# EAGLE schematic sheet (EAGLE 7.2.0)
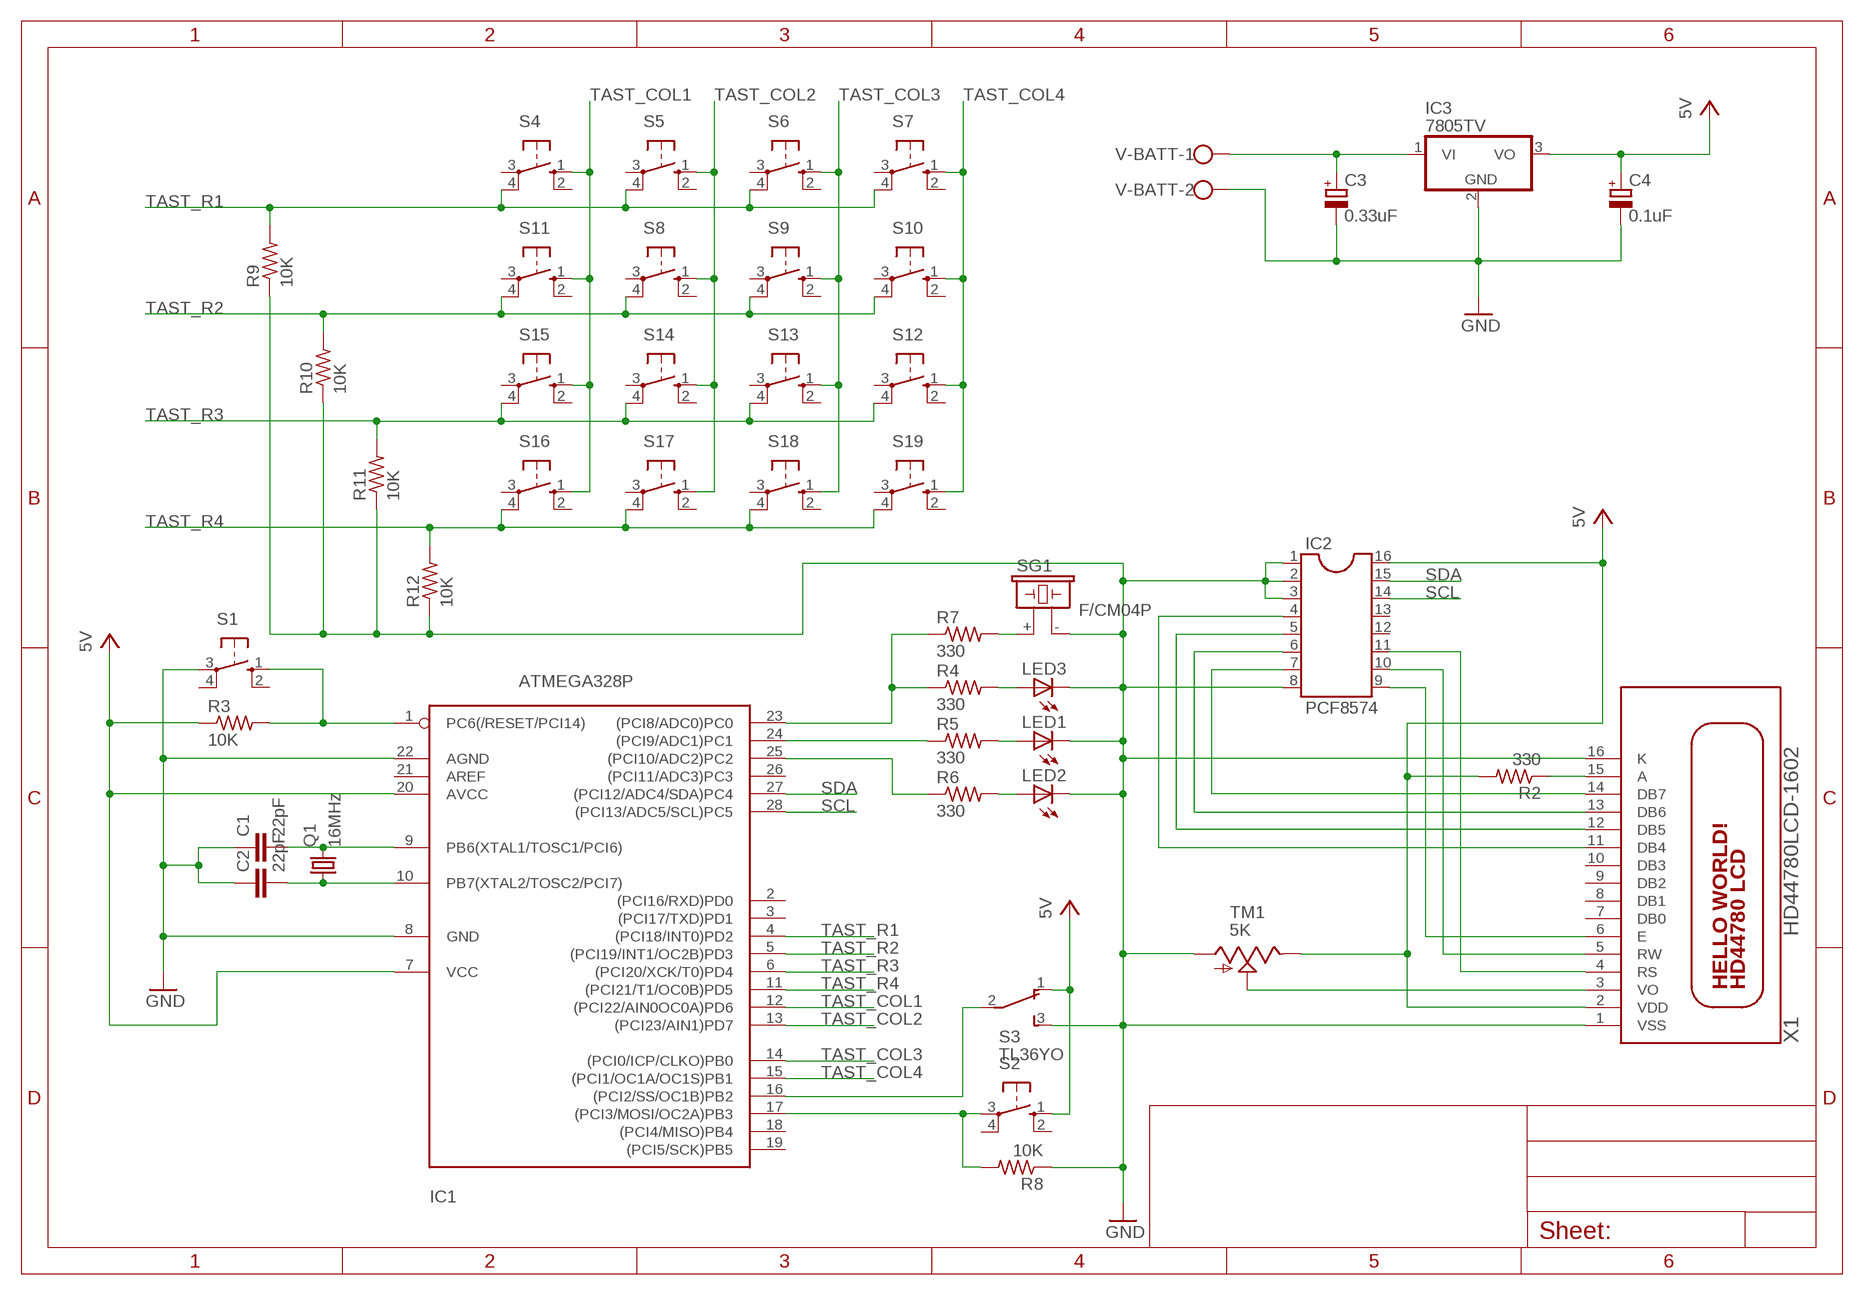
[diagram p0: schematic, sheet 1]

## Parts
C1  22pF  C-EU025-024X044  [C025-024X044]
C2  22pF  C-EU025-024X044  [C025-024X044]
C3  0.33uF  CPOL-EUE5-6  [E5-6]
C4  0.1uF  CPOL-EUE5-6  [E5-6]
FRAME1  A4L-LOC  [A4L-LOC]
IC1  ATMEGA328P  ATMEGA168-20P  [DIL28-3]
IC2  PCF8574  DIL16  [DIL16]
IC3  7805TV  [TO220V]
LED1  LED5MM  [LED5MM]
LED2  LED3MM  [LED3MM]
LED3  LED3MM  [LED3MM]
Q1  16MHz  CRYSTALHC49S  [HC49/S]
R2  330  R-US_0204/7  [0204/7]
R3  10K  R-US_0207/12  [0207/12]
R4  330  R-US_0207/12  [0207/12]
R5  330  R-US_0207/12  [0207/12]
R6  330  R-US_0207/12  [0207/12]
R7  330  R-US_0207/12  [0207/12]
R8  10K  R-US_0207/12  [0207/12]
R9  10K  R-US_0207/12  [0207/12]
R10  10K  R-US_0207/12  [0207/12]
R11  10K  R-US_0207/12  [0207/12]
R12  10K  R-US_0207/12  [0207/12]
S1  40-XX  [B3F-40XX]
S2  40-XX  [B3F-40XX]
S3  TL36YO  [TL3XYO]
S4  40-XX  [B3F-40XX]
S5  40-XX  [B3F-40XX]
S6  40-XX  [B3F-40XX]
S7  40-XX  [B3F-40XX]
S8  40-XX  [B3F-40XX]
S9  40-XX  [B3F-40XX]
S10  40-XX  [B3F-40XX]
S11  40-XX  [B3F-40XX]
S12  40-XX  [B3F-40XX]
S13  40-XX  [B3F-40XX]
S14  40-XX  [B3F-40XX]
S15  40-XX  [B3F-40XX]
S16  40-XX  [B3F-40XX]
S17  40-XX  [B3F-40XX]
S18  40-XX  [B3F-40XX]
S19  40-XX  [B3F-40XX]
SG1  F/CM04P  [F/CM04P]
TM1  5K  TRIM  [6MM]
V-BATT  W237-102  [W237-102]
X1  HD44780LCD-1602  [LCD1602]

## Nets
GND: C1.1 C2.1 C3.- C4.- IC1.8(GND) IC1.22(AGND) IC2.1 IC2.2 IC2.3 IC2.8 IC3.2(GND) LED1.K(C) LED2.K(C) LED3.K(C) R8.1 R9.1 R10.1 R11.1 R12.1 S1.3(P) S3.3(S) SG1.- TM1.A V-BATT.2 X1.1(VSS) X1.16(K)
N$1: IC2.9 X1.6(E)
N$2: R2.1 X1.15(A)
N$3: TM1.S X1.3(VO)
N$4: IC2.10 X1.5(RW)
N$5: IC2.11 X1.4(RS)
N$6: C1.2 IC1.9(PB6(XTAL1/TOSC1/PCI6)) Q1.2
N$7: C2.2 IC1.10(PB7(XTAL2/TOSC2/PCI7)) Q1.1
N$8: IC1.23((PCI8/ADC0)PC0) R4.1 R7.1
N$9: IC1.24((PCI9/ADC1)PC1) R5.1
N$10: IC2.4 X1.11(DB4)
N$11: IC2.5 X1.12(DB5)
N$12: IC2.6 X1.13(DB6)
N$13: IC2.7 X1.14(DB7)
N$14: IC1.1(PC6(/RESET/PCI14)) R3.2 S1.1(S)
N$15: IC1.25((PCI10/ADC2)PC2) R6.1
N$16: LED3.A R4.2
N$17: LED1.A R5.2
N$18: LED2.A R6.2
N$19: R7.2 SG1.+
N$20: IC1.16((PCI2/SS/OC1B)PB2) S3.2(P)
N$21: IC1.17((PCI3/MOSI/OC2A)PB3) R8.2 S2.3(P)
N$22: C3.+ IC3.1(VI) V-BATT.1
SCL: IC1.28((PCI13/ADC5/SCL)PC5) IC2.14
SDA: IC1.27((PCI12/ADC4/SDA)PC4) IC2.15
TAST_COL1: IC1.12((PCI22/AIN0OC0A)PD6) S4.1(S) S11.1(S) S15.1(S) S16.1(S)
TAST_COL2: IC1.13((PCI23/AIN1)PD7) S5.1(S) S8.1(S) S14.1(S) S17.1(S)
TAST_COL3: IC1.14((PCI0/ICP/CLKO)PB0) S6.1(S) S9.1(S) S13.1(S) S18.1(S)
TAST_COL4: IC1.15((PCI1/OC1A/OC1S)PB1) S7.1(S) S10.1(S) S12.1(S) S19.1(S)
TAST_R1: IC1.4((PCI18/INT0)PD2) R9.2 S4.4(P1) S5.4(P1) S6.4(P1) S7.4(P1)
TAST_R2: IC1.5((PCI19/INT1/OC2B)PD3) R10.2 S8.4(P1) S9.4(P1) S10.4(P1) S11.4(P1)
TAST_R3: IC1.6((PCI20/XCK/T0)PD4) R11.2 S12.4(P1) S13.4(P1) S14.4(P1) S15.4(P1)
TAST_R4: IC1.11((PCI21/T1/OC0B)PD5) R12.2 S16.4(P1) S17.4(P1) S18.4(P1) S19.4(P1)
VCC: C4.+ IC1.7(VCC) IC1.20(AVCC) IC2.16 IC3.3(VO) R2.2 R3.1 S2.1(S) S3.1(O) TM1.E X1.2(VDD) ; supply symbol labelled 5V
Unconnected: IC1.2((PCI16/RXD)PD0) IC1.3((PCI17/TXD)PD1) IC1.18((PCI4/MISO)PB4) IC1.19((PCI5/SCK)PB5) IC1.21(AREF) IC1.26((PCI11/ADC3)PC3) IC2.12 IC2.13 S1.2(S1) S1.4(P1) S2.2(S1) S2.4(P1) S4.2(S1) S4.3(P) S5.2(S1) S5.3(P) S6.2(S1) S6.3(P) S7.2(S1) S7.3(P) S8.2(S1) S8.3(P) S9.2(S1) S9.3(P) S10.2(S1) S10.3(P) S11.2(S1) S11.3(P) S12.2(S1) S12.3(P) S13.2(S1) S13.3(P) S14.2(S1) S14.3(P) S15.2(S1) S15.3(P) S16.2(S1) S16.3(P) S17.2(S1) S17.3(P) S18.2(S1) S18.3(P) S19.2(S1) S19.3(P) X1.7(DB0) X1.8(DB1) X1.9(DB2) X1.10(DB3)

## Library data of the parts
C1 C2 = resistor:C-EU: CAPACITOR, European symbol
C3 C4 = resistor:CPOL-EU: POLARIZED CAPACITOR, European symbol
FRAME1 = frames:A4L-LOC: FRAME DIN A4, landscape with location and doc. field; DATE: 23/03/2015; PAGES: 1/1; REV: V1.0; SHEET_NAME: Soft Bomb
IC1 = adafruit:ATMEGA168*P: MICROCONTROLLER 16 kBytes FLASH 1 kBytes SRAM 512 Bytes EEPROM USART 8-channel 10 bit ADC
IC2 = ic-package:DIL16: Dual In Line / Socket
IC3 = linear:78*: Positive VOLTAGE REGULATOR Source: http://cache.national.com/ds/LM/LM78L05.pdf http://www.fairchildsemi.com/ds/LM/LM7805.pdf
LED1-LED3 = adafruit:LED: LED OSRAM: - CHIPLED LG R971, LG N971, LY N971, LG Q971, LY Q971, LO R971, LY R971 LH N974, LH R974 LS Q976, LO Q976, LY Q976 LO Q996 - Hyper CHIPLED LW Q18S LB Q993, LB Q99A, LB R99A - SideLED LS A670, LO A670, LY A670, LG A670, LP A670 LB A673, LV A673, LT A673, LW A673 LH A674 LY A675 LS A676, LA A676, LO A676, LY A676, LW A676 LS A679, LY A679, LG A679 - Hyper Micro SIDELED® LS Y876, LA Y876, LO Y876, LY Y876 LT Y87S - SmartLED LW L88C, LW L88S LB L89C, LB L89S, LG L890 LS L89K, LO L89K, LY L89K LS L896, LA L896, LO L896, LY L896 - TOPLED LS T670, LO T670, LY T670, LG T670, LP T670 LSG T670, LSP T670, LSY T670, LOP T670, LYG T670 LG T671, LOG T671, LSG T671 LB T673, LV T673, LT T673, LW T673 LH T674 LS T676, LA T676, LO T676, LY T676, LB T676, LH T676, LSB T676, LW T676 LB T67C, LV T67C, LT T67C, LS T67K, LO T67K, LY T67K, LW E67C LS E67B, LA E67B, LO E67B, LY E67B, LB E67C, LV E67C, LT E67C LW T67C LS T679, LY T679, LG T679 LS T770, LO T770, LY T770, LG T770, LP T770 LB T773, LV T773, LT T773, LW T773 LH T774 LS E675, LA E675, LY E675, LS T675 LS T776, LA T776, LO T776, LY T776, LB T776 LHGB T686 LT T68C, LB T68C - Hyper Mini TOPLED® LB M676 - Mini TOPLED Santana® LG M470 LS M47K, LO M47K, LY M47K Source: http://www.osram.convergy.de/
Q1 = adafruit:CRYSTAL: CRYSTAL; OC_FARNELL: 1667008; OC_NEWARK: unknown
R2 = adafruit:R-US_: RESISTOR, American symbol
R3-R12 = resistor:R-US_: RESISTOR, American symbol
S1 S2 S4-S19 = adafruit:40-XX: OMRON SWITCH; MF: OMRON COMPONENTS USA; MPN: B3F-4000; OC_FARNELL: 176434; OC_NEWARK: 36K3105
S3 = switch:TL36YO: TINY SWITCH ON - ON Source: http://www2.produktinfo.conrad.com/datenblaetter/700000-724999/705152-da-01-de-Subminiaturschalter_TL_36YO.pdf
SG1 = buzzer:F/CM04P: BUZZER Source: Buerklin; OC_FARNELL: unknown; OC_NEWARK: unknown
TM1 = adafruit:TRIM
V-BATT = con-wago-500:W237-102: WAGO SCREW CLAMP; MPN: 237-102; OC_FARNELL: unknown; OC_NEWARK: 70K9898
X1 = adafruit:HD44780LCD: HD44780 LCD Standard character type LCDs, available in sizes from 8x1 to 40x4!